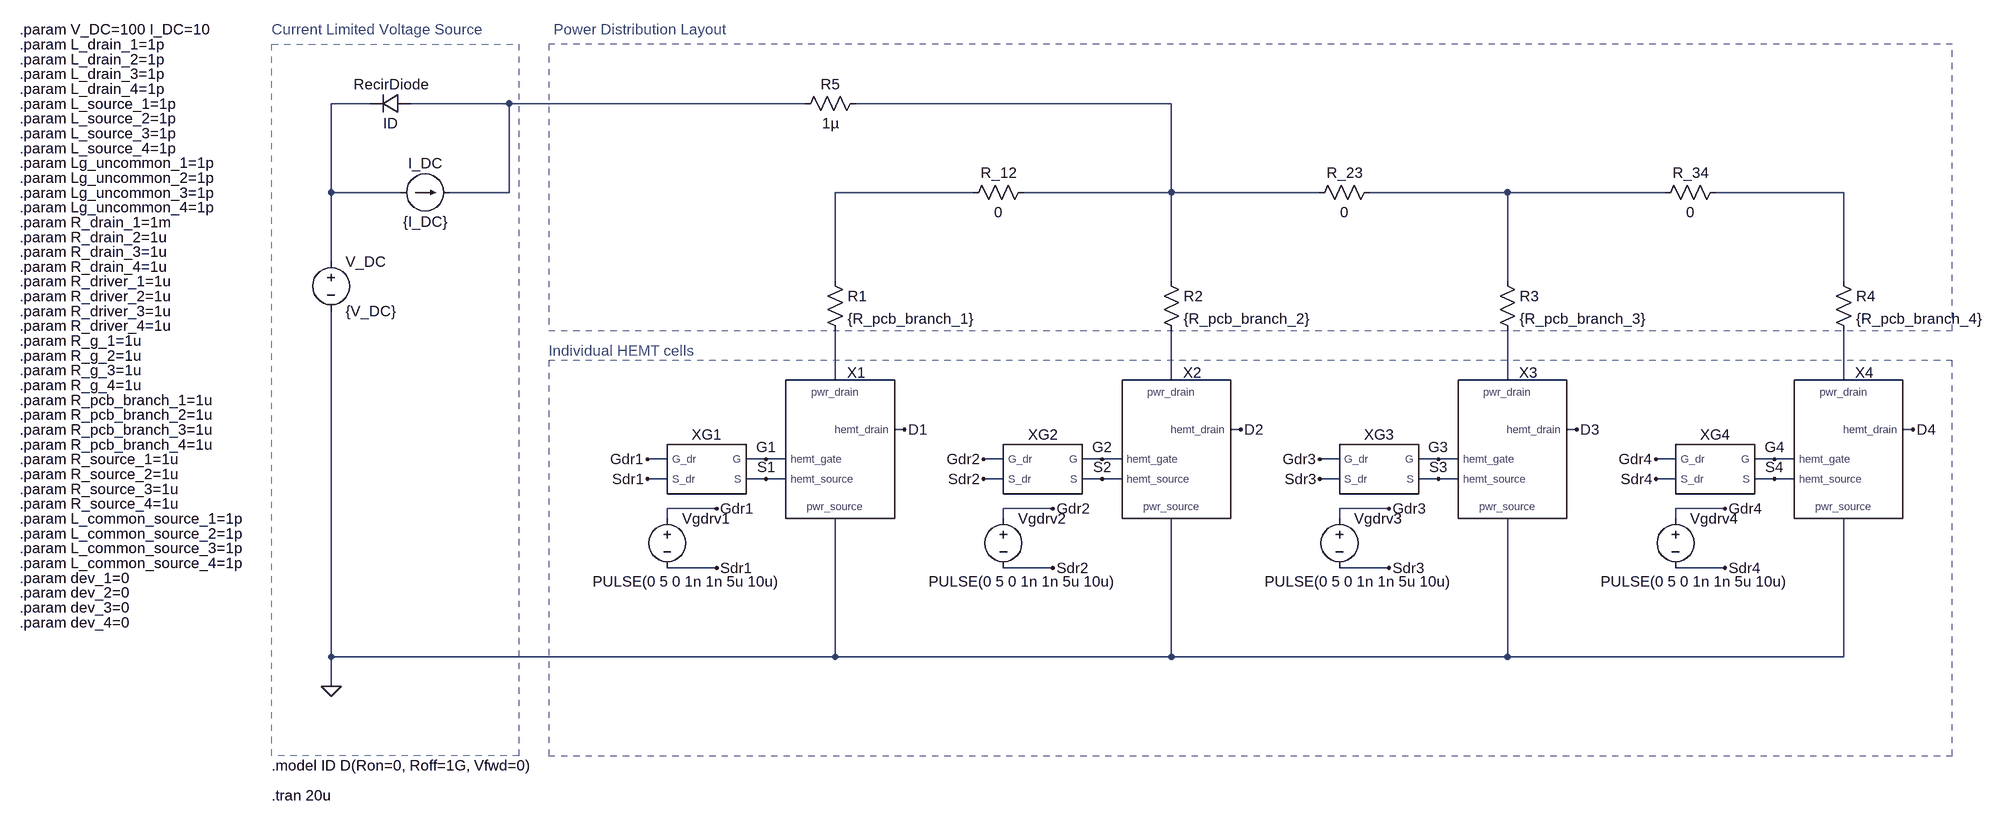
[diagram p0: schematic ParGan_V2.asc]
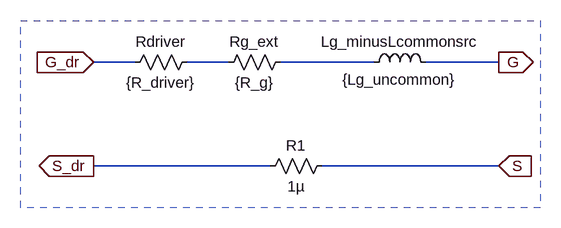
[diagram p1: sub-circuit gate_cell_v1.asc]
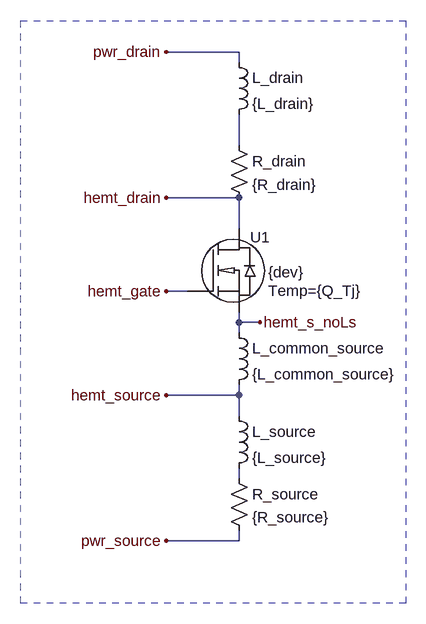
[diagram p2: sub-circuit hemt_cell_v2.asc]
ParGan_V2.asc, the LTspice schematic file:
Version 4.1
SHEET 1 3100 1136
WIRE -416 -464 -480 -464
WIRE -192 -464 -352 -464
WIRE 288 -464 -192 -464
WIRE 880 -464 368 -464
WIRE -480 -320 -480 -464
WIRE -368 -320 -480 -320
WIRE -192 -320 -192 -464
WIRE -192 -320 -288 -320
WIRE 560 -320 336 -320
WIRE 880 -320 880 -464
WIRE 880 -320 640 -320
WIRE 1120 -320 880 -320
WIRE 1424 -320 1200 -320
WIRE 1680 -320 1424 -320
WIRE 1968 -320 1760 -320
WIRE -480 -208 -480 -320
WIRE 336 -176 336 -320
WIRE 880 -176 880 -320
WIRE 1424 -176 1424 -320
WIRE 1968 -176 1968 -320
WIRE 336 -16 336 -96
WIRE 880 -16 880 -96
WIRE 1424 -16 1424 -96
WIRE 1968 -16 1968 -96
WIRE 448 64 432 64
WIRE 992 64 976 64
WIRE 1536 64 1520 64
WIRE 2080 64 2064 64
WIRE 64 112 32 112
WIRE 224 112 192 112
WIRE 256 112 224 112
WIRE 608 112 576 112
WIRE 768 112 736 112
WIRE 800 112 768 112
WIRE 1152 112 1120 112
WIRE 1312 112 1280 112
WIRE 1344 112 1312 112
WIRE 1696 112 1664 112
WIRE 1856 112 1824 112
WIRE 1888 112 1856 112
WIRE 64 144 32 144
WIRE 224 144 192 144
WIRE 256 144 224 144
WIRE 608 144 576 144
WIRE 768 144 736 144
WIRE 800 144 768 144
WIRE 1152 144 1120 144
WIRE 1312 144 1280 144
WIRE 1344 144 1312 144
WIRE 1696 144 1664 144
WIRE 1856 144 1824 144
WIRE 1888 144 1856 144
WIRE 144 192 64 192
WIRE 688 192 608 192
WIRE 1232 192 1152 192
WIRE 1776 192 1696 192
WIRE 64 208 64 192
WIRE 608 208 608 192
WIRE 1152 208 1152 192
WIRE 1696 208 1696 192
WIRE 144 288 64 288
WIRE 688 288 608 288
WIRE 1232 288 1152 288
WIRE 1776 288 1696 288
WIRE -480 432 -480 -128
WIRE 336 432 336 208
WIRE 336 432 -480 432
WIRE 880 432 880 208
WIRE 880 432 336 432
WIRE 1424 432 1424 208
WIRE 1424 432 880 432
WIRE 1968 432 1968 208
WIRE 1968 432 1424 432
WIRE -480 480 -480 432
FLAG -480 480 0
FLAG 448 64 D1
FLAG 224 112 G1
FLAG 224 144 S1
FLAG 32 112 Gdr1
FLAG 32 144 Sdr1
FLAG 144 192 Gdr1
FLAG 144 288 Sdr1
FLAG 992 64 D2
FLAG 768 112 G2
FLAG 768 144 S2
FLAG 576 112 Gdr2
FLAG 576 144 Sdr2
FLAG 688 192 Gdr2
FLAG 688 288 Sdr2
FLAG 1536 64 D3
FLAG 1312 112 G3
FLAG 1312 144 S3
FLAG 1120 112 Gdr3
FLAG 1120 144 Sdr3
FLAG 1232 192 Gdr3
FLAG 1232 288 Sdr3
FLAG 2080 64 D4
FLAG 1856 112 G4
FLAG 1856 144 S4
FLAG 1664 112 Gdr4
FLAG 1664 144 Sdr4
FLAG 1776 192 Gdr4
FLAG 1776 288 Sdr4
SYMBOL voltage -480 -224 R0
WINDOW 123 0 0 Left 0
WINDOW 39 0 0 Left 0
SYMATTR InstName V_DC
SYMATTR Value {V_DC}
SYMBOL voltage 64 192 R0
WINDOW 123 0 0 Left 0
WINDOW 39 0 0 Left 0
WINDOW 3 -121 118 Left 2
SYMATTR Value PULSE(0 5 0 1n 1n 5u 10u)
SYMATTR InstName Vgdrv1
SYMBOL gate_cell_V1 144 128 R0
SYMATTR InstName XG1
SYMATTR SpiceLine Lg_uncommon={Lg_uncommon_1} R_driver={R_driver_1} R_g={R_g_1}
SYMBOL voltage 608 192 R0
WINDOW 123 0 0 Left 0
WINDOW 39 0 0 Left 0
WINDOW 3 -121 118 Left 2
SYMATTR Value PULSE(0 5 0 1n 1n 5u 10u)
SYMATTR InstName Vgdrv2
SYMBOL gate_cell_V1 688 128 R0
SYMATTR InstName XG2
SYMATTR SpiceLine Lg_uncommon={Lg_uncommon_2} R_driver={R_driver_2} R_g={R_g_2}
SYMBOL res 320 -192 R0
SYMATTR InstName R1
SYMATTR Value {R_pcb_branch_1}
SYMBOL current -368 -320 R270
WINDOW 0 32 40 VTop 2
WINDOW 3 -32 40 VBottom 2
WINDOW 123 0 0 Left 0
WINDOW 39 0 0 Left 0
SYMATTR InstName I_DC
SYMATTR Value {I_DC}
SYMBOL diode -352 -480 R90
WINDOW 0 0 32 VBottom 2
WINDOW 3 32 32 VTop 2
SYMATTR InstName RecirDiode
SYMATTR Value ID
SYMBOL res 864 -192 R0
SYMATTR InstName R2
SYMATTR Value {R_pcb_branch_2}
SYMBOL voltage 1152 192 R0
WINDOW 123 0 0 Left 0
WINDOW 39 0 0 Left 0
WINDOW 3 -121 118 Left 2
SYMATTR Value PULSE(0 5 0 1n 1n 5u 10u)
SYMATTR InstName Vgdrv3
SYMBOL gate_cell_V1 1232 128 R0
SYMATTR InstName XG3
SYMATTR SpiceLine Lg_uncommon={Lg_uncommon_3} R_driver={R_driver_3} R_g={R_g_3}
SYMBOL voltage 1696 192 R0
WINDOW 123 0 0 Left 0
WINDOW 39 0 0 Left 0
WINDOW 3 -121 118 Left 2
SYMATTR Value PULSE(0 5 0 1n 1n 5u 10u)
SYMATTR InstName Vgdrv4
SYMBOL gate_cell_V1 1776 128 R0
SYMATTR InstName XG4
SYMATTR SpiceLine Lg_uncommon={Lg_uncommon_4} R_driver={R_driver_4} R_g={R_g_4}
SYMBOL res 1408 -192 R0
SYMATTR InstName R3
SYMATTR Value {R_pcb_branch_3}
SYMBOL res 1952 -192 R0
SYMATTR InstName R4
SYMATTR Value {R_pcb_branch_4}
SYMBOL res 656 -336 R90
WINDOW 0 0 56 VBottom 2
WINDOW 3 32 56 VTop 2
SYMATTR InstName R_12
SYMATTR Value 0
SYMBOL res 1216 -336 R90
WINDOW 0 0 56 VBottom 2
WINDOW 3 32 56 VTop 2
SYMATTR InstName R_23
SYMATTR Value 0
SYMBOL res 1776 -336 R90
WINDOW 0 0 56 VBottom 2
WINDOW 3 32 56 VTop 2
SYMATTR InstName R_34
SYMATTR Value 0
SYMBOL res 384 -480 R90
WINDOW 0 0 56 VBottom 2
WINDOW 3 32 56 VTop 2
SYMATTR InstName R5
SYMATTR Value 1µ
SYMBOL hemt_cell_V2 352 112 R0
SYMATTR InstName X1
SYMATTR SpiceLine R_drain={R_drain_1} L_drain={L_drain_1} R_source={R_source_1} L_source={L_source_1} L_common_source={L_common_source_1} dev=table(dev_1, 0, "EPC2305", 1, "EPC2305_modified")
SYMBOL hemt_cell_V2 896 112 R0
SYMATTR InstName X2
SYMATTR SpiceLine R_drain={R_drain_2} L_drain={L_drain_2} R_source={R_source_2} L_source={L_source_2} L_common_source={L_common_source_2} dev=table(dev_2, 0, "EPC2305", 1, "EPC2305_modified")
SYMBOL hemt_cell_V2 1440 112 R0
SYMATTR InstName X3
SYMATTR SpiceLine R_drain={R_drain_3} L_drain={L_drain_3} R_source={R_source_3} L_source={L_source_3} L_common_source={L_common_source_3} dev=table(dev_3, 0, "EPC2305", 1, "EPC2305_modified")
SYMBOL hemt_cell_V2 1984 112 R0
SYMATTR InstName X4
SYMATTR SpiceLine R_drain={R_drain_4} L_drain={L_drain_4} R_source={R_source_4} L_source={L_source_4} L_common_source={L_common_source_4} dev=table(dev_4, 0, "EPC2305", 1, "EPC2305_modified")
TEXT -576 656 Left 2 !.tran 20u
TEXT -576 608 Left 2 !.model ID D(Ron=0, Roff=1G, Vfwd=0)
TEXT -576 -584 Left 2 ;Current Limited Voltage Source
TEXT -120 -584 Left 2 ;Power Distribution Layout
TEXT -128 -64 Left 2 ;Individual HEMT cells
TEXT -984 -584 Left 2 !.param V_DC=100 I_DC=10
TEXT -984 -560 Left 2 !.param L_drain_1=1p
TEXT -984 -536 Left 2 !.param L_drain_2=1p
TEXT -984 -512 Left 2 !.param L_drain_3=1p
TEXT -984 -488 Left 2 !.param L_drain_4=1p
TEXT -984 -464 Left 2 !.param L_source_1=1p
TEXT -984 -440 Left 2 !.param L_source_2=1p
TEXT -984 -416 Left 2 !.param L_source_3=1p
TEXT -984 -392 Left 2 !.param L_source_4=1p
TEXT -984 -368 Left 2 !.param Lg_uncommon_1=1p
TEXT -984 -344 Left 2 !.param Lg_uncommon_2=1p
TEXT -984 -320 Left 2 !.param Lg_uncommon_3=1p
TEXT -984 -296 Left 2 !.param Lg_uncommon_4=1p
TEXT -984 -272 Left 2 !.param R_drain_1=1m
TEXT -984 -248 Left 2 !.param R_drain_2=1u
TEXT -984 -224 Left 2 !.param R_drain_3=1u
TEXT -984 -200 Left 2 !.param R_drain_4=1u
TEXT -984 -176 Left 2 !.param R_driver_1=1u
TEXT -984 -152 Left 2 !.param R_driver_2=1u
TEXT -984 -128 Left 2 !.param R_driver_3=1u
TEXT -984 -104 Left 2 !.param R_driver_4=1u
TEXT -984 -80 Left 2 !.param R_g_1=1u
TEXT -984 -56 Left 2 !.param R_g_2=1u
TEXT -984 -32 Left 2 !.param R_g_3=1u
TEXT -984 -8 Left 2 !.param R_g_4=1u
TEXT -984 16 Left 2 !.param R_pcb_branch_1=1u
TEXT -984 40 Left 2 !.param R_pcb_branch_2=1u
TEXT -984 64 Left 2 !.param R_pcb_branch_3=1u
TEXT -984 88 Left 2 !.param R_pcb_branch_4=1u
TEXT -984 112 Left 2 !.param R_source_1=1u
TEXT -984 136 Left 2 !.param R_source_2=1u
TEXT -984 160 Left 2 !.param R_source_3=1u
TEXT -984 184 Left 2 !.param R_source_4=1u
TEXT -984 208 Left 2 !.param L_common_source_1=1p
TEXT -984 232 Left 2 !.param L_common_source_2=1p
TEXT -984 256 Left 2 !.param L_common_source_3=1p
TEXT -984 280 Left 2 !.param L_common_source_4=1p
TEXT -984 304 Left 2 !.param dev_1=0
TEXT -984 328 Left 2 !.param dev_2=0
TEXT -984 352 Left 2 !.param dev_3=0
TEXT -984 376 Left 2 !.param dev_4=0
RECTANGLE Normal 2144 -560 -128 -96 3
RECTANGLE Normal 2144 -48 -128 592 3
RECTANGLE Normal -176 592 -576 -560 3

gate_cell_v1.asc, the sub-circuit schematic file:
Version 4.1
SHEET 1 880 788
WIRE -176 96 -240 96
WIRE -32 96 -96 96
WIRE 192 96 48 96
WIRE 384 96 272 96
WIRE 32 256 -240 256
WIRE 384 256 112 256
FLAG -240 96 G_dr
IOPIN -240 96 In
FLAG -240 256 S_dr
IOPIN -240 256 Out
FLAG 384 96 G
IOPIN 384 96 Out
FLAG 384 256 S
IOPIN 384 256 In
SYMBOL res 64 80 R90
WINDOW 0 0 56 VBottom 2
WINDOW 3 32 56 VTop 2
SYMATTR InstName Rg_ext
SYMATTR Value {R_g}
SYMBOL ind 176 112 R270
WINDOW 0 32 56 VTop 2
WINDOW 3 5 56 VBottom 2
SYMATTR InstName Lg_minusLcommonsrc
SYMATTR Value {Lg_uncommon}
SYMBOL res -80 80 R90
WINDOW 0 0 56 VBottom 2
WINDOW 3 32 56 VTop 2
SYMATTR InstName Rdriver
SYMATTR Value {R_driver}
SYMBOL res 128 240 R90
WINDOW 0 0 56 VBottom 2
WINDOW 3 32 56 VTop 2
SYMATTR InstName R1
SYMATTR Value 1µ
RECTANGLE Normal 448 320 -352 32 3

hemt_cell_v2.asc, the sub-circuit schematic file:
Version 4.1
SHEET 1 1704 680
WIRE 672 -352 560 -352
WIRE 672 -336 672 -352
WIRE 672 -208 672 -256
WIRE 672 -128 560 -128
WIRE 672 -80 672 -128
WIRE 592 16 560 16
WIRE 672 64 672 48
WIRE 704 64 672 64
WIRE 672 80 672 64
WIRE 672 176 672 160
WIRE 672 176 560 176
WIRE 672 208 672 176
WIRE 672 304 672 288
WIRE 672 400 672 384
WIRE 672 400 560 400
FLAG 560 176 hemt_source
FLAG 560 16 hemt_gate
FLAG 560 -128 hemt_drain
FLAG 560 -352 pwr_drain
FLAG 560 400 pwr_source
FLAG 704 64 hemt_s_noLs
SYMBOL res 656 -224 R0
SYMATTR InstName R_drain
SYMATTR Value {R_drain}
SYMBOL ind 656 -352 R0
SYMATTR InstName L_drain
SYMATTR Value {L_drain}
SYMBOL ind 656 192 R0
SYMATTR InstName L_source
SYMATTR Value {L_source}
SYMBOL res 656 288 R0
SYMATTR InstName R_source
SYMATTR Value {R_source}
SYMBOL ind 656 64 R0
SYMATTR InstName L_common_source
SYMATTR Value {L_common_source}
SYMBOL EPCGaN 592 16 R0
WINDOW 123 125 -1 Left 0
SYMATTR InstName U1
SYMATTR Value {dev}
SYMATTR Value2 Temp={Q_Tj}
RECTANGLE Normal 928 496 336 -400 3

The netlist it stands for:
* ParGan_V2.asc
V_DC N001 0 {V_DC}
Vgdrv1 Gdr1 Sdr1 PULSE(0 5 0 1n 1n 5u 10u)
X§XG1 Gdr1 S1 G1 Sdr1 gate_cell_v1 params: Lg_uncommon={Lg_uncommon_1} R_driver={R_driver_1} R_g={R_g_1}
Vgdrv2 Gdr2 Sdr2 PULSE(0 5 0 1n 1n 5u 10u)
X§XG2 Gdr2 S2 G2 Sdr2 gate_cell_v1 params: Lg_uncommon={Lg_uncommon_2} R_driver={R_driver_2} R_g={R_g_2}
R1 N004 N007 {R_pcb_branch_1}
I_DC N001 N002 {I_DC}
D§RecirDiode N002 N001 ID
R2 N003 N008 {R_pcb_branch_2}
Vgdrv3 Gdr3 Sdr3 PULSE(0 5 0 1n 1n 5u 10u)
X§XG3 Gdr3 S3 G3 Sdr3 gate_cell_v1 params: Lg_uncommon={Lg_uncommon_3} R_driver={R_driver_3} R_g={R_g_3}
Vgdrv4 Gdr4 Sdr4 PULSE(0 5 0 1n 1n 5u 10u)
X§XG4 Gdr4 S4 G4 Sdr4 gate_cell_v1 params: Lg_uncommon={Lg_uncommon_4} R_driver={R_driver_4} R_g={R_g_4}
R3 N005 N009 {R_pcb_branch_3}
R4 N006 N010 {R_pcb_branch_4}
R_12 N003 N004 0
R_23 N005 N003 0
R_34 N006 N005 0
R5 N003 N002 1µ
X§X1 D1 G1 S1 N007 0 hemt_cell_v2 params: R_drain={R_drain_1} L_drain={L_drain_1} R_source={R_source_1} L_source={L_source_1} L_common_source={L_common_source_1} dev=table(dev_1, 0, "EPC2305", 1, "EPC2305_modified")
X§X2 D2 G2 S2 N008 0 hemt_cell_v2 params: R_drain={R_drain_2} L_drain={L_drain_2} R_source={R_source_2} L_source={L_source_2} L_common_source={L_common_source_2} dev=table(dev_2, 0, "EPC2305", 1, "EPC2305_modified")
X§X3 D3 G3 S3 N009 0 hemt_cell_v2 params: R_drain={R_drain_3} L_drain={L_drain_3} R_source={R_source_3} L_source={L_source_3} L_common_source={L_common_source_3} dev=table(dev_3, 0, "EPC2305", 1, "EPC2305_modified")
X§X4 D4 G4 S4 N010 0 hemt_cell_v2 params: R_drain={R_drain_4} L_drain={L_drain_4} R_source={R_source_4} L_source={L_source_4} L_common_source={L_common_source_4} dev=table(dev_4, 0, "EPC2305", 1, "EPC2305_modified")

* block symbol definitions
.subckt gate_cell_v1 G_dr S G S_dr
Rg_ext N002 N001 {R_g}
Lg_minusLcommonsrc N002 G {Lg_uncommon}
Rdriver N001 G_dr {R_driver}
R1 S S_dr 1µ
.ends gate_cell_v1

.subckt hemt_cell_v2 hemt_drain hemt_gate hemt_source pwr_drain pwr_source
R_drain N001 hemt_drain {R_drain}
L_drain pwr_drain N001 {L_drain}
L_source hemt_source N002 {L_source}
R_source N002 pwr_source {R_source}
L_common_source hemt_s_noLs hemt_source {L_common_source}
X§U1 hemt_gate hemt_drain hemt_s_noLs {dev} Temp={Q_Tj}  ; pins gatein drainin sourcein
.ends hemt_cell_v2

.model D D
.lib standard.dio
.tran 20u
.model ID D(Ron=0, Roff=1G, Vfwd=0)
* Current Limited Voltage Source
* Power Distribution Layout
* Individual HEMT cells
.param V_DC=100 I_DC=10
.param L_drain_1=1p
.param L_drain_2=1p
.param L_drain_3=1p
.param L_drain_4=1p
.param L_source_1=1p
.param L_source_2=1p
.param L_source_3=1p
.param L_source_4=1p
.param Lg_uncommon_1=1p
.param Lg_uncommon_2=1p
.param Lg_uncommon_3=1p
.param Lg_uncommon_4=1p
.param R_drain_1=1m
.param R_drain_2=1u
.param R_drain_3=1u
.param R_drain_4=1u
.param R_driver_1=1u
.param R_driver_2=1u
.param R_driver_3=1u
.param R_driver_4=1u
.param R_g_1=1u
.param R_g_2=1u
.param R_g_3=1u
.param R_g_4=1u
.param R_pcb_branch_1=1u
.param R_pcb_branch_2=1u
.param R_pcb_branch_3=1u
.param R_pcb_branch_4=1u
.param R_source_1=1u
.param R_source_2=1u
.param R_source_3=1u
.param R_source_4=1u
.param L_common_source_1=1p
.param L_common_source_2=1p
.param L_common_source_3=1p
.param L_common_source_4=1p
.param dev_1=0
.param dev_2=0
.param dev_3=0
.param dev_4=0
.lib hemt_cell_V1
.lib EPCGanlibrary.lib
.backanno
.end